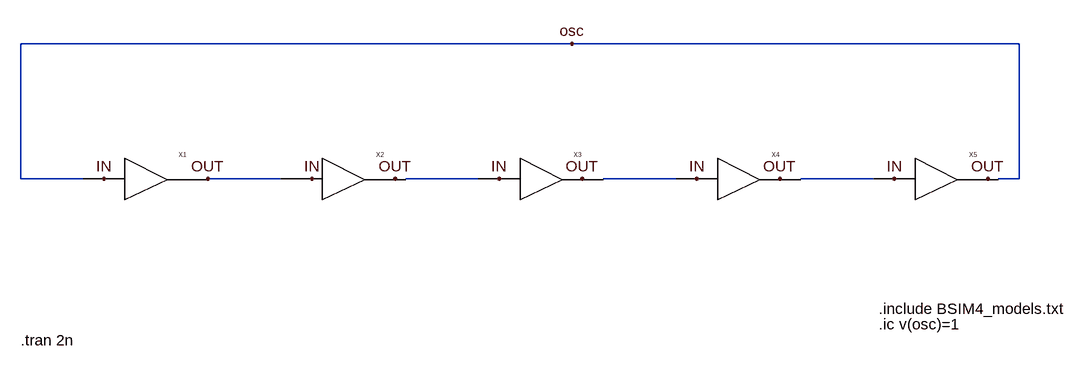
[diagram p0: schematic Ring_Oscillator.asc]
Ring_Oscillator.asc, the LTspice schematic file:
Version 4
SHEET 1 2820 680
WIRE 320 -48 -528 -48
WIRE 1008 -48 320 -48
WIRE -528 160 -528 -48
WIRE -432 160 -528 160
WIRE -128 160 -240 160
WIRE 176 160 64 160
WIRE 480 160 368 160
WIRE 784 160 672 160
WIRE 1008 160 1008 -48
WIRE 1008 160 976 160
FLAG 320 -48 osc
FLAG -400 160 IN
FLAG -80 160 IN
FLAG 208 160 IN
FLAG 512 160 IN
FLAG 816 160 IN
FLAG -240 160 OUT
FLAG 48 160 OUT
FLAG 336 160 OUT
FLAG 640 160 OUT
FLAG 960 160 OUT
SYMBOL CMOS_ring -336 160 R0
SYMATTR InstName X1
SYMBOL CMOS_ring -32 160 R0
SYMATTR InstName X2
SYMBOL CMOS_ring 272 160 R0
SYMATTR InstName X3
SYMBOL CMOS_ring 576 160 R0
SYMATTR InstName X4
SYMBOL CMOS_ring 880 160 R0
SYMATTR InstName X5
TEXT 792 360 Left 2 !.include BSIM4_models.txt
TEXT 792 384 Left 2 !.ic v(osc)=1
TEXT -528 408 Left 2 !.tran 2n

The netlist it stands for:
* Ring_Oscillator.asc
XX1 osc OUT CMOS_ring  ; pins IN OUT
XX2 OUT N001 CMOS_ring  ; pins IN OUT
XX3 N001 N002 CMOS_ring  ; pins IN OUT
XX4 N002 N003 CMOS_ring  ; pins IN OUT
XX5 N003 osc CMOS_ring  ; pins IN OUT
.include BSIM4_models.txt
.ic v(osc)=1
.tran 2n
.backanno
.end